# EAGLE schematic Interface v1_6 (EAGLE 7.7.0), part 2 of 2
## Sheet 13 of 14: TempMotor 2
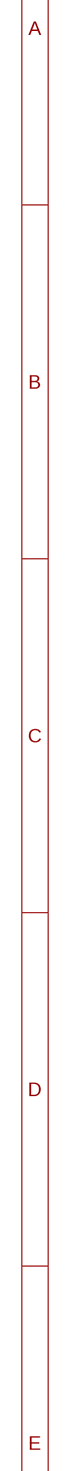
[diagram p19: schematic, sheet 13, part 1 of 2]
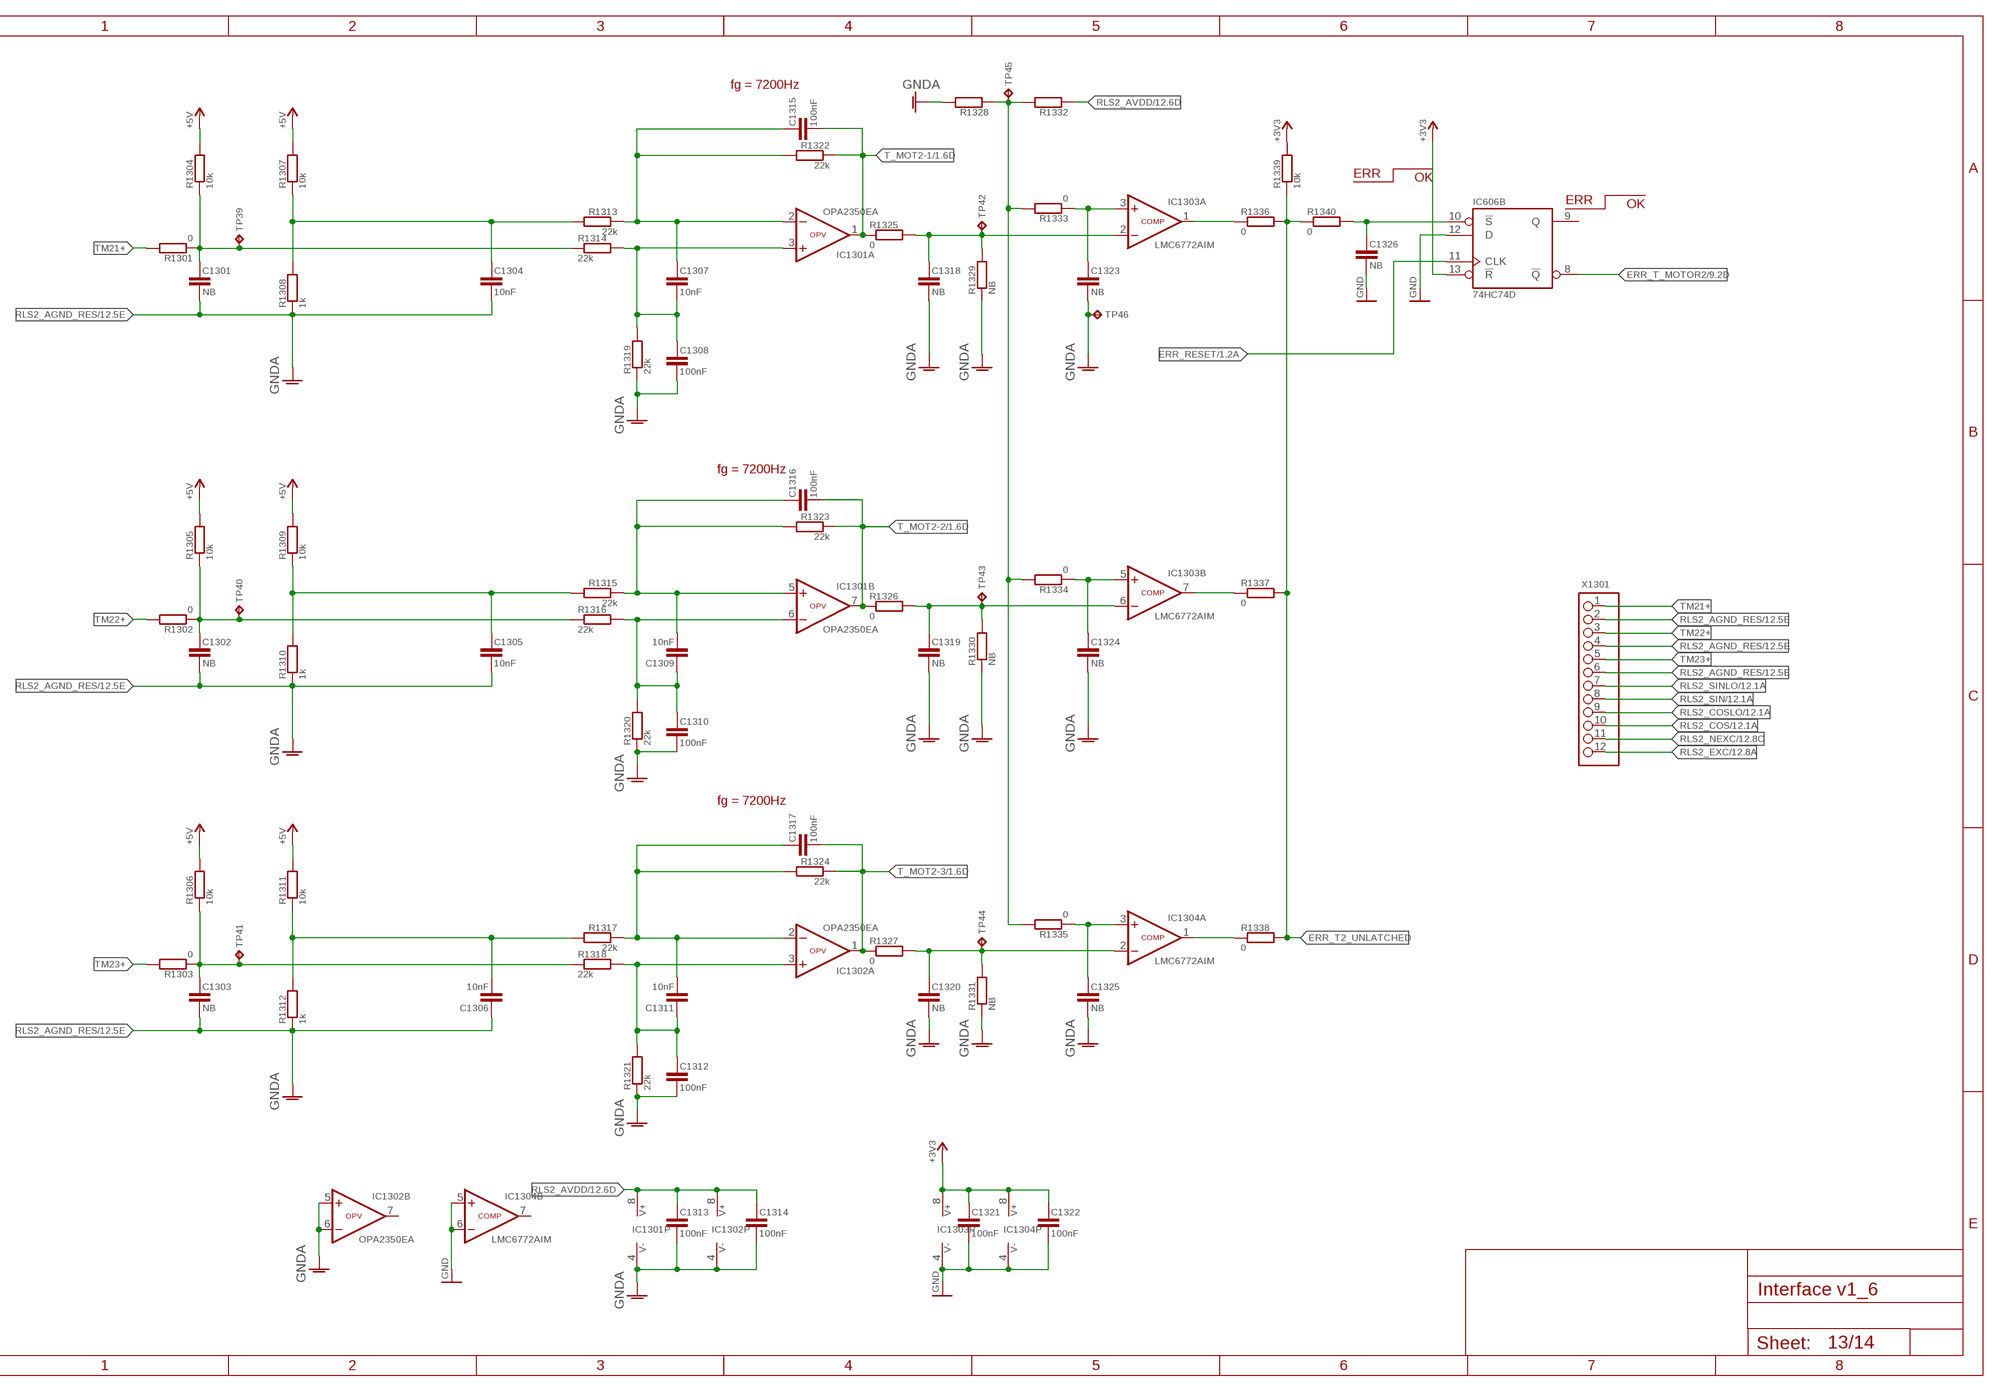
[diagram p20: schematic, sheet 13, part 2 of 2]

### Parts
C1301  NB  C-0805"  [C-0805"]
C1302  NB  C-0805"  [C-0805"]
C1303  NB  C-0805"  [C-0805"]
C1304  10nF  C-0805"  [C-0805"]
C1305  10nF  C-0805"  [C-0805"]
C1306  10nF  C-0805"  [C-0805"]
C1307  10nF  C-0805"  [C-0805"]
C1308  100nF  C-0805"  [C-0805"]
C1309  10nF  C-0805"  [C-0805"]
C1310  100nF  C-0805"  [C-0805"]
C1311  10nF  C-0805"  [C-0805"]
C1312  100nF  C-0805"  [C-0805"]
C1313  100nF  C-0805"  [C-0805"]
C1314  100nF  C-0805"  [C-0805"]
C1315  100nF  C-0805"  [C-0805"]
C1316  100nF  C-0805"  [C-0805"]
C1317  100nF  C-0805"  [C-0805"]
C1318  NB  C-0805"  [C-0805"]
C1319  NB  C-0805"  [C-0805"]
C1320  NB  C-0805"  [C-0805"]
C1321  100nF  C-0805"  [C-0805"]
C1322  100nF  C-0805"  [C-0805"]
C1323  NB  C-0805"  [C-0805"]
C1324  NB  C-0805"  [C-0805"]
C1325  NB  C-0805"  [C-0805"]
C1326  NB  C-0805"  [C-0805"]
IC1301  OPA2350EA  OPV-2-SOIC  [SOIC8]
IC1302  OPA2350EA  OPV-2-SOIC  [SOIC8]
IC1303  LMC6772AIM  COMP-OC-2-SOIC  [SOIC8]
IC1304  LMC6772AIM  COMP-OC-2-SOIC  [SOIC8]
R1301  0  R-0805"  [R-0805"]
R1302  0  R-0805"  [R-0805"]
R1303  0  R-0805"  [R-0805"]
R1304  10k  R-0805"  [R-0805"]
R1305  10k  R-0805"  [R-0805"]
R1306  10k  R-0805"  [R-0805"]
R1307  10k  R-0805"  [R-0805"]
R1308  1k  R-0805"  [R-0805"]
R1309  10k  R-0805"  [R-0805"]
R1310  1k  R-0805"  [R-0805"]
R1311  10k  R-0805"  [R-0805"]
R1312  1k  R-0805"  [R-0805"]
R1313  22k  R-0805"  [R-0805"]
R1314  22k  R-0805"  [R-0805"]
R1315  22k  R-0805"  [R-0805"]
R1316  22k  R-0805"  [R-0805"]
R1317  22k  R-0805"  [R-0805"]
R1318  22k  R-0805"  [R-0805"]
R1319  22k  R-0805"  [R-0805"]
R1320  22k  R-0805"  [R-0805"]
R1321  22k  R-0805"  [R-0805"]
R1322  22k  R-0805"  [R-0805"]
R1323  22k  R-0805"  [R-0805"]
R1324  22k  R-0805"  [R-0805"]
R1325  0  R-0805"  [R-0805"]
R1326  0  R-0805"  [R-0805"]
R1327  0  R-0805"  [R-0805"]
R1328  R-0805"  [R-0805"]
R1329  NB  R-0805"  [R-0805"]
R1330  NB  R-0805"  [R-0805"]
R1331  NB  R-0805"  [R-0805"]
R1332  R-0805"  [R-0805"]
R1333  0  R-0805"  [R-0805"]
R1334  0  R-0805"  [R-0805"]
R1335  0  R-0805"  [R-0805"]
R1336  0  R-0805"  [R-0805"]
R1337  0  R-0805"  [R-0805"]
R1338  0  R-0805"  [R-0805"]
R1339  10k  R-0805"  [R-0805"]
R1340  0  R-0805"  [R-0805"]
TP39  TP-TH-08  [TP-08]
TP40  TP-TH-08  [TP-08]
TP41  TP-TH-08  [TP-08]
TP42  TP-TH-08  [TP-08]
TP43  TP-TH-08  [TP-08]
TP44  TP-TH-08  [TP-08]
TP45  TP-TH-08  [TP-08]
TP46  TP-TH-12  [TP-12]
X1301  MINIBRIDGE12-GERADE  [MINIBRIDGE12-GERADE]

### Nets
+3V3 [VDD]: C1321.1 C1322.1 IC606.13(B:!R) IC1303.8(P:V+) IC1304.8(P:V+) R1339.2 ; also sheet 1,2,3,4,5,6,7,8,9,11
+5V [VDD]: R1304.2 R1305.2 R1306.2 R1307.2 R1309.2 R1311.2 ; also sheet 1,2,3,4,5,6,7,10,12
ERR_RESET: IC606.11(B:CLK) ; also sheet 1,3,4,5,6,7,11
ERR_T2_UNLATCHED: R1336.2 R1337.2 R1338.2 R1339.1 R1340.1
ERR_T_MOTOR2: IC606.8(B:!Q) ; also sheet 9
GND: C1321.2 C1322.2 C1326.2 IC606.12(B:D) IC1303.4(P:V-) IC1304.4(P:V-) IC1304.5(B:+IN) IC1304.6(B:-IN) ; also sheet 1,2,3,4,5,6,7,8,9,10,11,12,14
N$1: IC1303.1(A:OUT) R1336.1
N$27: IC1303.7(B:OUT) R1337.1
N$74: IC1304.1(A:OUT) R1338.1
N$79: C1301.1 R1301.1 R1304.1 R1314.1 TP39.TP
N$113: C1307.1 C1315.1 IC1301.2(A:-IN) R1313.1 R1322.2
N$114: C1307.2 C1308.1 IC1301.3(A:+IN) R1314.2 R1319.2
N$119: C1302.1 R1302.1 R1305.1 R1316.1 TP40.TP
N$120: C1309.1 C1310.1 IC1301.6(B:-IN) R1316.2 R1320.2
N$122: C1303.1 R1303.1 R1306.1 R1318.1 TP41.TP
N$124: C1311.2 C1317.1 IC1302.2(A:-IN) R1317.1 R1324.2
N$125: C1311.1 C1312.1 IC1302.3(A:+IN) R1318.2 R1321.2
N$127: C1323.1 IC1303.3(A:+IN) R1333.1
N$128: C1324.1 IC1303.5(B:+IN) R1334.1
N$129: C1325.1 IC1304.3(A:+IN) R1335.1
N$140: C1309.2 C1316.1 IC1301.5(B:+IN) R1315.1 R1323.2
N$142: C1304.1 R1307.1 R1308.2 R1313.2
N$148: C1305.1 R1309.1 R1310.2 R1315.2
N$149: C1306.2 R1311.1 R1312.2 R1317.2
N$152: C1326.1 IC606.10(B:!S) R1340.2
RLS2_AGND_RES: C1301.2 C1302.2 C1303.2 C1304.2 C1305.2 C1306.1 C1308.2 C1310.2 C1312.2 C1313.2 C1314.2 C1318.2 C1319.2 C1320.2 C1323.2 C1324.2 C1325.2 IC1301.4(P:V-) IC1302.4(P:V-) IC1302.5(B:+IN) IC1302.6(B:-IN) R1308.1 R1310.1 R1312.1 R1319.1 R1320.1 R1321.1 R1328.2 R1329.1 R1330.1 R1331.1 TP46.TP X1301.2 X1301.4 X1301.6 ; supply symbol labelled GNDA ; also sheet 12
RLS2_AVDD: C1313.1 C1314.1 IC1301.8(P:V+) IC1302.8(P:V+) R1332.1 ; also sheet 12
RLS2_COS: X1301.10 ; also sheet 12
RLS2_COSLO: X1301.9 ; also sheet 12
RLS2_EXC: X1301.12 ; also sheet 12
RLS2_NEXC: X1301.11 ; also sheet 12
RLS2_SIN: X1301.8 ; also sheet 12
RLS2_SINLO: X1301.7 ; also sheet 12
T_M1-1_A1: C1318.1 IC1303.2(A:-IN) R1325.2 R1329.2 TP42.TP
T_M1-2_A1: C1319.1 IC1303.6(B:-IN) R1326.2 R1330.2 TP43.TP
T_M1-3_A1: C1320.1 IC1304.2(A:-IN) R1327.2 R1331.2 TP44.TP
T_MOT2-1: C1315.2 IC1301.1(A:OUT) R1322.1 R1325.1 ; also sheet 1
T_MOT2-2: C1316.2 IC1301.7(B:OUT) R1323.1 R1326.1 ; also sheet 1
T_MOT2-3: C1317.2 IC1302.1(A:OUT) R1324.1 R1327.1 ; also sheet 1
TEMP_MAX1: R1328.1 R1332.2 R1333.2 R1334.2 R1335.2 TP45.TP
TM21+: R1301.2 X1301.1
TM22+: R1302.2 X1301.3
TM23+: R1303.2 X1301.5
Unconnected: IC606.9(B:Q) IC1302.7(B:OUT) IC1304.7(B:OUT)

### Notes on the sheet
- fg = 7200Hz
- ERR
- OK
- ERR
- OK
- fg = 7200Hz
- fg = 7200Hz

## Sheet 14 of 14
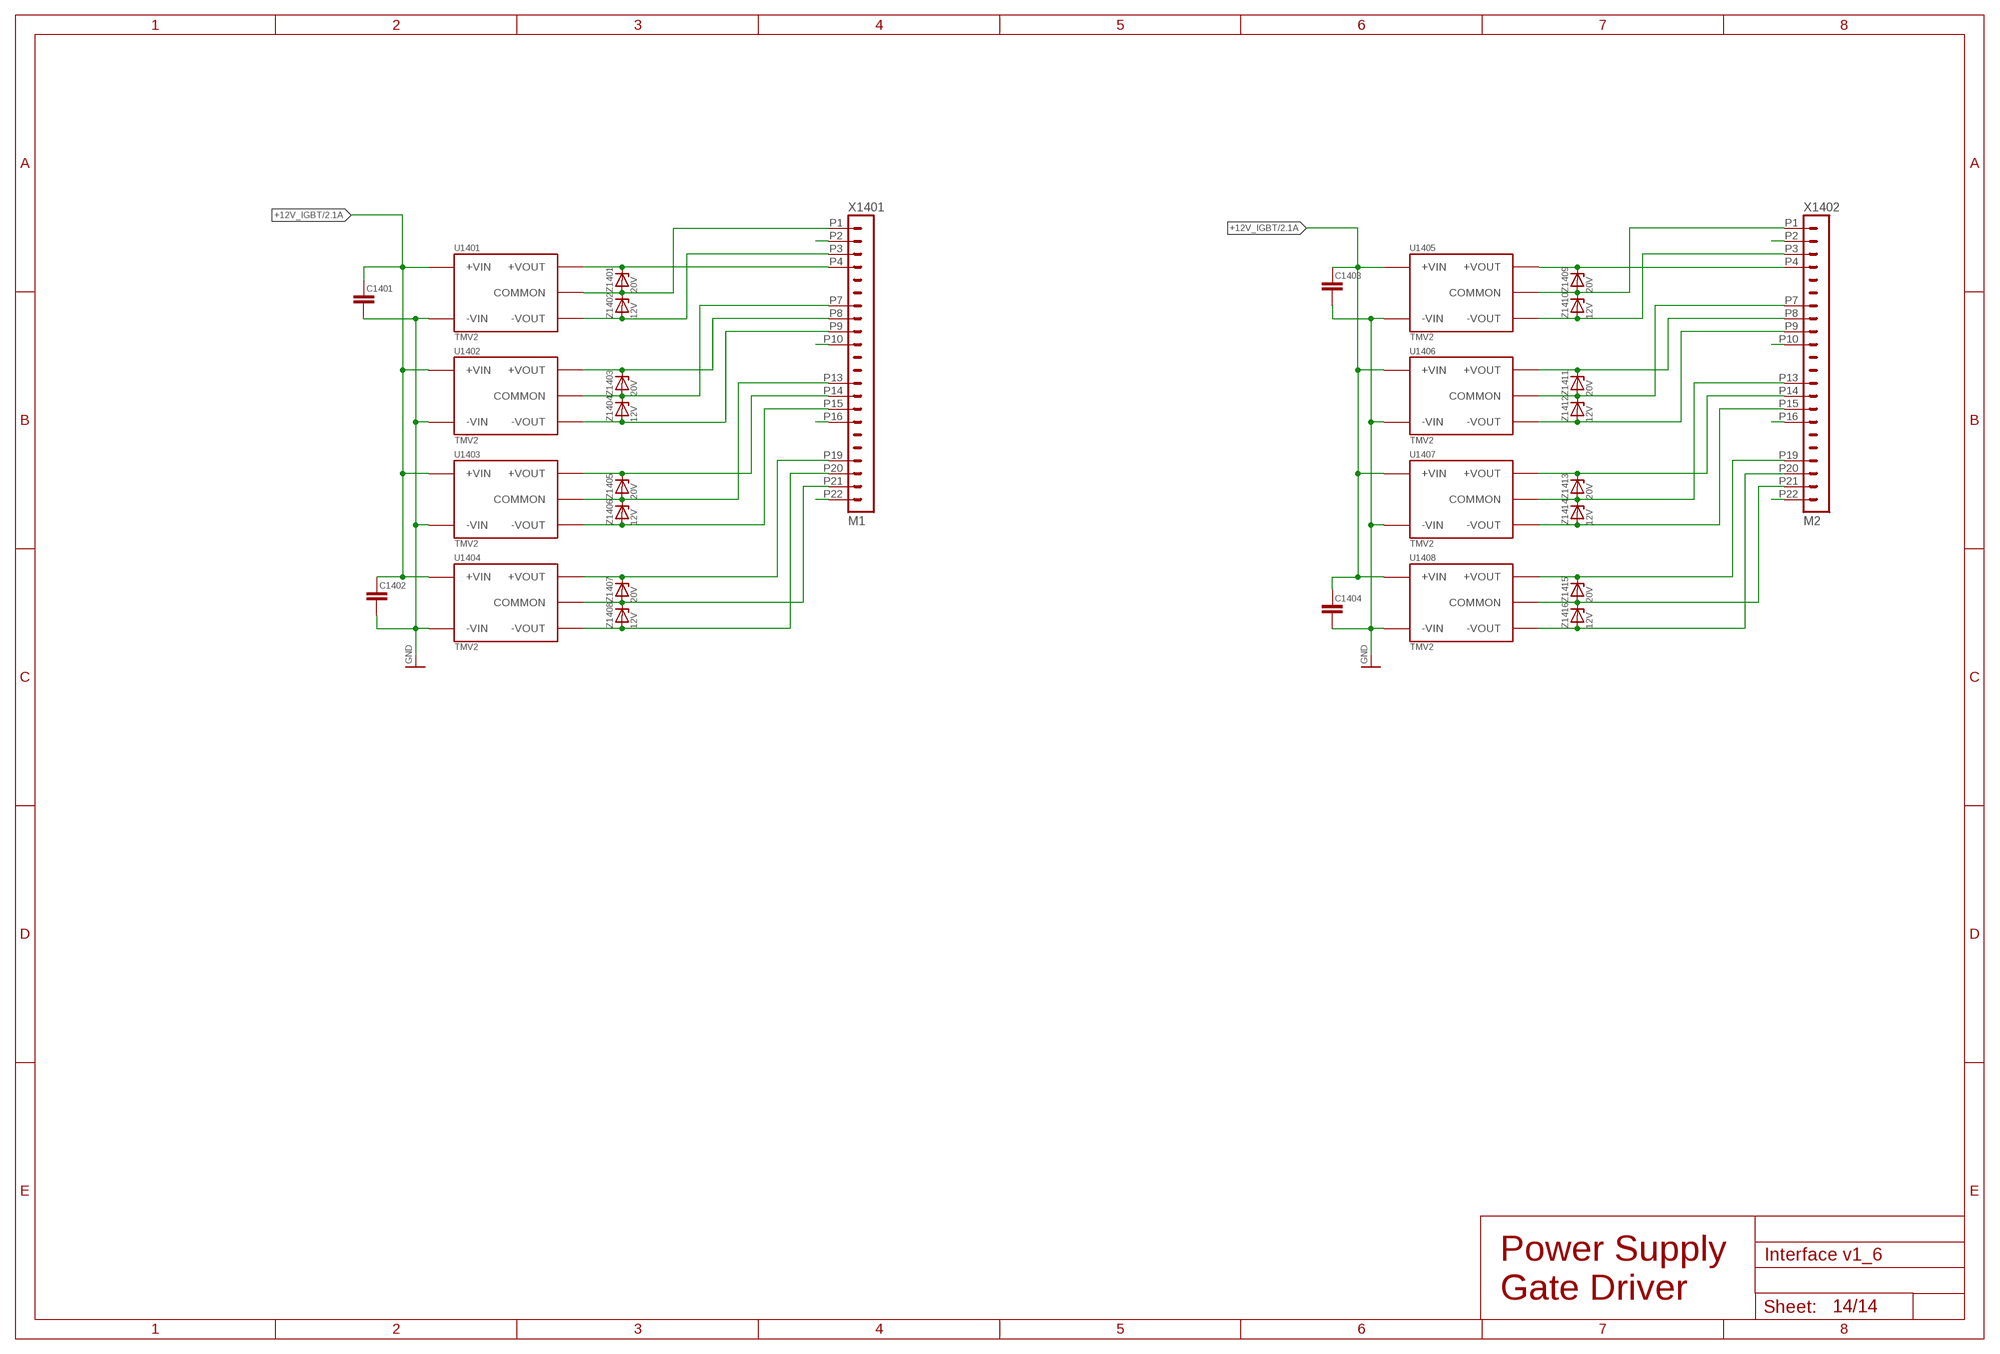
[diagram p21: schematic, sheet 14]

### Parts
C1401  C-0805"  [C-0805"]
C1402  C-0805"  [C-0805"]
C1403  C-0805"  [C-0805"]
C1404  C-0805"  [C-0805"]
U1401  TMV2  [TMV2]
U1402  TMV2  [TMV2]
U1403  TMV2  [TMV2]
U1404  TMV2  [TMV2]
U1405  TMV2  [TMV2]
U1406  TMV2  [TMV2]
U1407  TMV2  [TMV2]
U1408  TMV2  [TMV2]
X1401  M1  22  [44769-2201_EUGEN]
X1402  M2  22  [44769-2201_EUGEN]
Z1401  20V  ZENER-DIODE-SOD123W  [D-SOD123W]
Z1402  12V  ZENER-DIODE-SOD123W  [D-SOD123W]
Z1403  20V  ZENER-DIODE-SOD123W  [D-SOD123W]
Z1404  12V  ZENER-DIODE-SOD123W  [D-SOD123W]
Z1405  20V  ZENER-DIODE-SOD123W  [D-SOD123W]
Z1406  12V  ZENER-DIODE-SOD123W  [D-SOD123W]
Z1407  20V  ZENER-DIODE-SOD123W  [D-SOD123W]
Z1408  12V  ZENER-DIODE-SOD123W  [D-SOD123W]
Z1409  20V  ZENER-DIODE-SOD123W  [D-SOD123W]
Z1410  12V  ZENER-DIODE-SOD123W  [D-SOD123W]
Z1411  20V  ZENER-DIODE-SOD123W  [D-SOD123W]
Z1412  12V  ZENER-DIODE-SOD123W  [D-SOD123W]
Z1413  20V  ZENER-DIODE-SOD123W  [D-SOD123W]
Z1414  12V  ZENER-DIODE-SOD123W  [D-SOD123W]
Z1415  20V  ZENER-DIODE-SOD123W  [D-SOD123W]
Z1416  12V  ZENER-DIODE-SOD123W  [D-SOD123W]

### Nets
+12V_IGBT [VDD]: C1401.1 C1402.1 C1403.1 C1404.1 U1401.1(+VIN) U1402.1(+VIN) U1403.1(+VIN) U1404.1(+VIN) U1405.1(+VIN) U1406.1(+VIN) U1407.1(+VIN) U1408.1(+VIN) ; also sheet 2
GND: C1401.2 C1402.2 C1403.2 C1404.2 U1401.2(-VIN) U1402.2(-VIN) U1403.2(-VIN) U1404.2(-VIN) U1405.2(-VIN) U1406.2(-VIN) U1407.2(-VIN) U1408.2(-VIN) ; also sheet 1,2,3,4,5,6,7,8,9,10,11,12,13
GND_1B [HV_1B]: U1404.6(COMMON) X1401.P21 Z1407.A(A1) Z1408.C(C1)
GND_U1T [HV_UT]: U1401.6(COMMON) X1401.P1 Z1401.A(A1) Z1402.C(C1)
GND_U2T [HV_UT]: U1405.6(COMMON) X1402.P1 Z1409.A(A1) Z1410.C(C1)
GND_V1T [HV_VT]: U1402.6(COMMON) X1401.P7 Z1403.A(A1) Z1404.C(C1)
GND_W1T [HV_WT]: U1403.6(COMMON) X1401.P13 Z1405.A(A1) Z1406.C(C1)
N$13 [HV_UT]: X1401.P2
N$14 [HV_VT]: X1401.P10
N$16 [HV_WT]: X1401.P16
N$21 [HV_1B]: X1401.P22
N$30 [HV_UT]: X1402.P2
N$32 [HV_VT]: X1402.P10
N$36 [HV_WT]: X1402.P16
N$40 [HV_1B]: X1402.P22
N$115 [HV_VT]: U1406.7(+VOUT) X1402.P8 Z1411.C(C1)
N$121 [HV_VT]: U1406.6(COMMON) X1402.P7 Z1411.A(A1) Z1412.C(C1)
N$126 [HV_VT]: U1406.5(-VOUT) X1402.P9 Z1412.A(A1)
N$156 [HV_WT]: U1407.7(+VOUT) X1402.P14 Z1413.C(C1)
N$157 [HV_WT]: U1407.6(COMMON) X1402.P13 Z1413.A(A1) Z1414.C(C1)
N$158 [HV_WT]: U1407.5(-VOUT) X1402.P15 Z1414.A(A1)
N$229 [HV_1B]: U1408.7(+VOUT) X1402.P19 Z1415.C(C1)
N$231 [HV_1B]: U1408.6(COMMON) X1402.P21 Z1415.A(A1) Z1416.C(C1)
N$232 [HV_1B]: U1408.5(-VOUT) X1402.P20 Z1416.A(A1)
VCC_1B [HV_1B]: U1404.7(+VOUT) X1401.P19 Z1407.C(C1)
VCC_U1T [HV_UT]: U1401.7(+VOUT) X1401.P4 Z1401.C(C1)
VCC_U2T [HV_UT]: U1405.7(+VOUT) X1402.P4 Z1409.C(C1)
VCC_V1T [HV_VT]: U1402.7(+VOUT) X1401.P8 Z1403.C(C1)
VCC_W1T [HV_WT]: U1403.7(+VOUT) X1401.P14 Z1405.C(C1)
VSS_1B [HV_1B]: U1404.5(-VOUT) X1401.P20 Z1408.A(A1)
VSS_U1T [HV_UT]: U1401.5(-VOUT) X1401.P3 Z1402.A(A1)
VSS_U2T [HV_UT]: U1405.5(-VOUT) X1402.P3 Z1410.A(A1)
VSS_V1T [HV_VT]: U1402.5(-VOUT) X1401.P9 Z1404.A(A1)
VSS_W1T [HV_WT]: U1403.5(-VOUT) X1401.P15 Z1406.A(A1)

### Notes on the sheet
- Power Supply
  Gate Driver

## Library data of the parts
C101-C115 C201 C203-C212 C301-C305 C401-C411 C501-C520 C601-C620 C701-C712 C801-C812 C901-C911 C1001-C1003 C1005 C1006 C1009-C1023 C1101-C1126 C1201-C1203 C1205 C1206 C1209-C1223 C1301-C1326 C1401-C1404 = null:C
C202 C1004 C1007 C1008 C1204 C1207 C1208 = null:C-POL
D101 D102 D201 D1001-D1004 D1201-D1204 = null:DIODE
DCDC201 DCDC202 = DCDC:TRS1
H201-H208 = holes:MOUNT-HOLE: MOUNTING HOLE with drill center marker
I501-I503 I601-I603 = TUWR:HC2F
IC201-IC203 = TUWR:LT1461
IC301 IC302 IC304 = null.logic:74*367: Hex BUS DRIVER, 3-state
IC303 IC305 = null.logic:74*32A
IC401 IC501 IC502 IC601 IC602 IC1101 IC1102 IC1301 IC1302 = null.linear:OPV-2
IC402 IC503-IC505 IC603-IC605 IC702 IC1103 IC1104 IC1303 IC1304 = null.linear:COMP-OC-2
IC403 IC506 IC606 IC703 = null.logic:74*74
IC701 = 74xx-eu:74*123: Retriggerable monostable MULTIVIBRATOR
IC801 IC802 IC901 IC902 = null.logic:74*21: Dual 4-input AND gate
IC803 IC903 = null.logic:74*02: Quad 2-input NOR gate
IC1001 IC1201 = HANSL_ERWEITERUNG_V1:AD2S1205: AD2S1205 12 Bit Resover to Digital Converter with Reference Oszillator http://www.analog.com/static/imported-files/data_sheets/AD2S1205.pdf
IC1002 IC1202 = HANSL_ERWEITERUNG_V1:TL084: OP AMP
IC1003 IC1203 = HANSL_ERWEITERUNG_V1:MAX6520: 1.2V Voltage Reference 50ppm/°C, SOT23, 3-Terminal Source: http://datasheets.maxim-ic.com/en/ds/MAX6520.pdf
IC1004 IC1204 = HANSL_ERWEITERUNG_V1:LMH6645; OC_FARNELL: unknown
J101 J102 J401 J501 J601 = TUWR:SMA
J301 J302 = con-molex-milli-grid:79109-22: RECEPTACAL
L501 L601 = rcl:L-EU: INDUCTOR, European symbol
L1001-L1003 L1201-L1203 = null:L
LED401 = null:LED
LP101 = Launchpad:LAUNCHPAD-CAN
Q1001 Q1201 = HANSL_ERWEITERUNG_V1:QUARZ10MHZ
R101-R117 R201-R203 R301-R314 R401-R419 R501-R528 R601-R628 R701-R716 R801-R822 R901-R921 R1001-R1025 R1101-R1140 R1201-R1225 R1301-R1340 = null:R
T401 T402 = TUWR:MMBF170LT1
T1001 T1003 T1201 T1203 = HANSL_ERWEITERUNG_V1:BC846: NPN TRANSISTOR
T1002 T1004 T1202 T1204 = HANSL_ERWEITERUNG_V1:*-PNP-: PNP Transistror
TP1-TP46 = null:TP
U1401-U1408 = DCDC:TMV2
X101 = null.connector:C10-2
X201 X1101 X1301 = TUWR_Minibridge:MINIBRIDGE12
X401 = minibridge:MINIBRIDGE6
X1401 X1402 = con-molex-micro-fit-3_0:22: Molex - Micro-Fit 3.0 Series connector, 3.00mm (0.118") pitch header, 22 positions.
Z1401-Z1416 = null:ZENER-DIODE

## Net classes
0 default: width 0.152 mm, drill 0.203 mm, clearance 0.152 mm
1 HV_UT: clearance 4 mm to class 0, clearance 0.15 mm
2 HV_VT: clearance 4 mm to class 0, clearance 4 mm to class 1, clearance 0.15 mm
3 HV_WT: clearance 4 mm to class 0, clearance 4 mm to class 1, clearance 4 mm to class 2, clearance 0.15 mm
4 HV_1B: clearance 4 mm to class 0, clearance 4 mm to class 1, clearance 4 mm to class 2, clearance 4 mm to class 3, clearance 0.15 mm
5 VDD: width 0.61 mm, clearance 0.152 mm to class 0, clearance 4 mm to class 1, clearance 4 mm to class 2, clearance 4 mm to class 3, clearance 4 mm to class 4, clearance 0.152 mm